# Altium schematic sheet STM32F10XV.SCHDOC
size A3
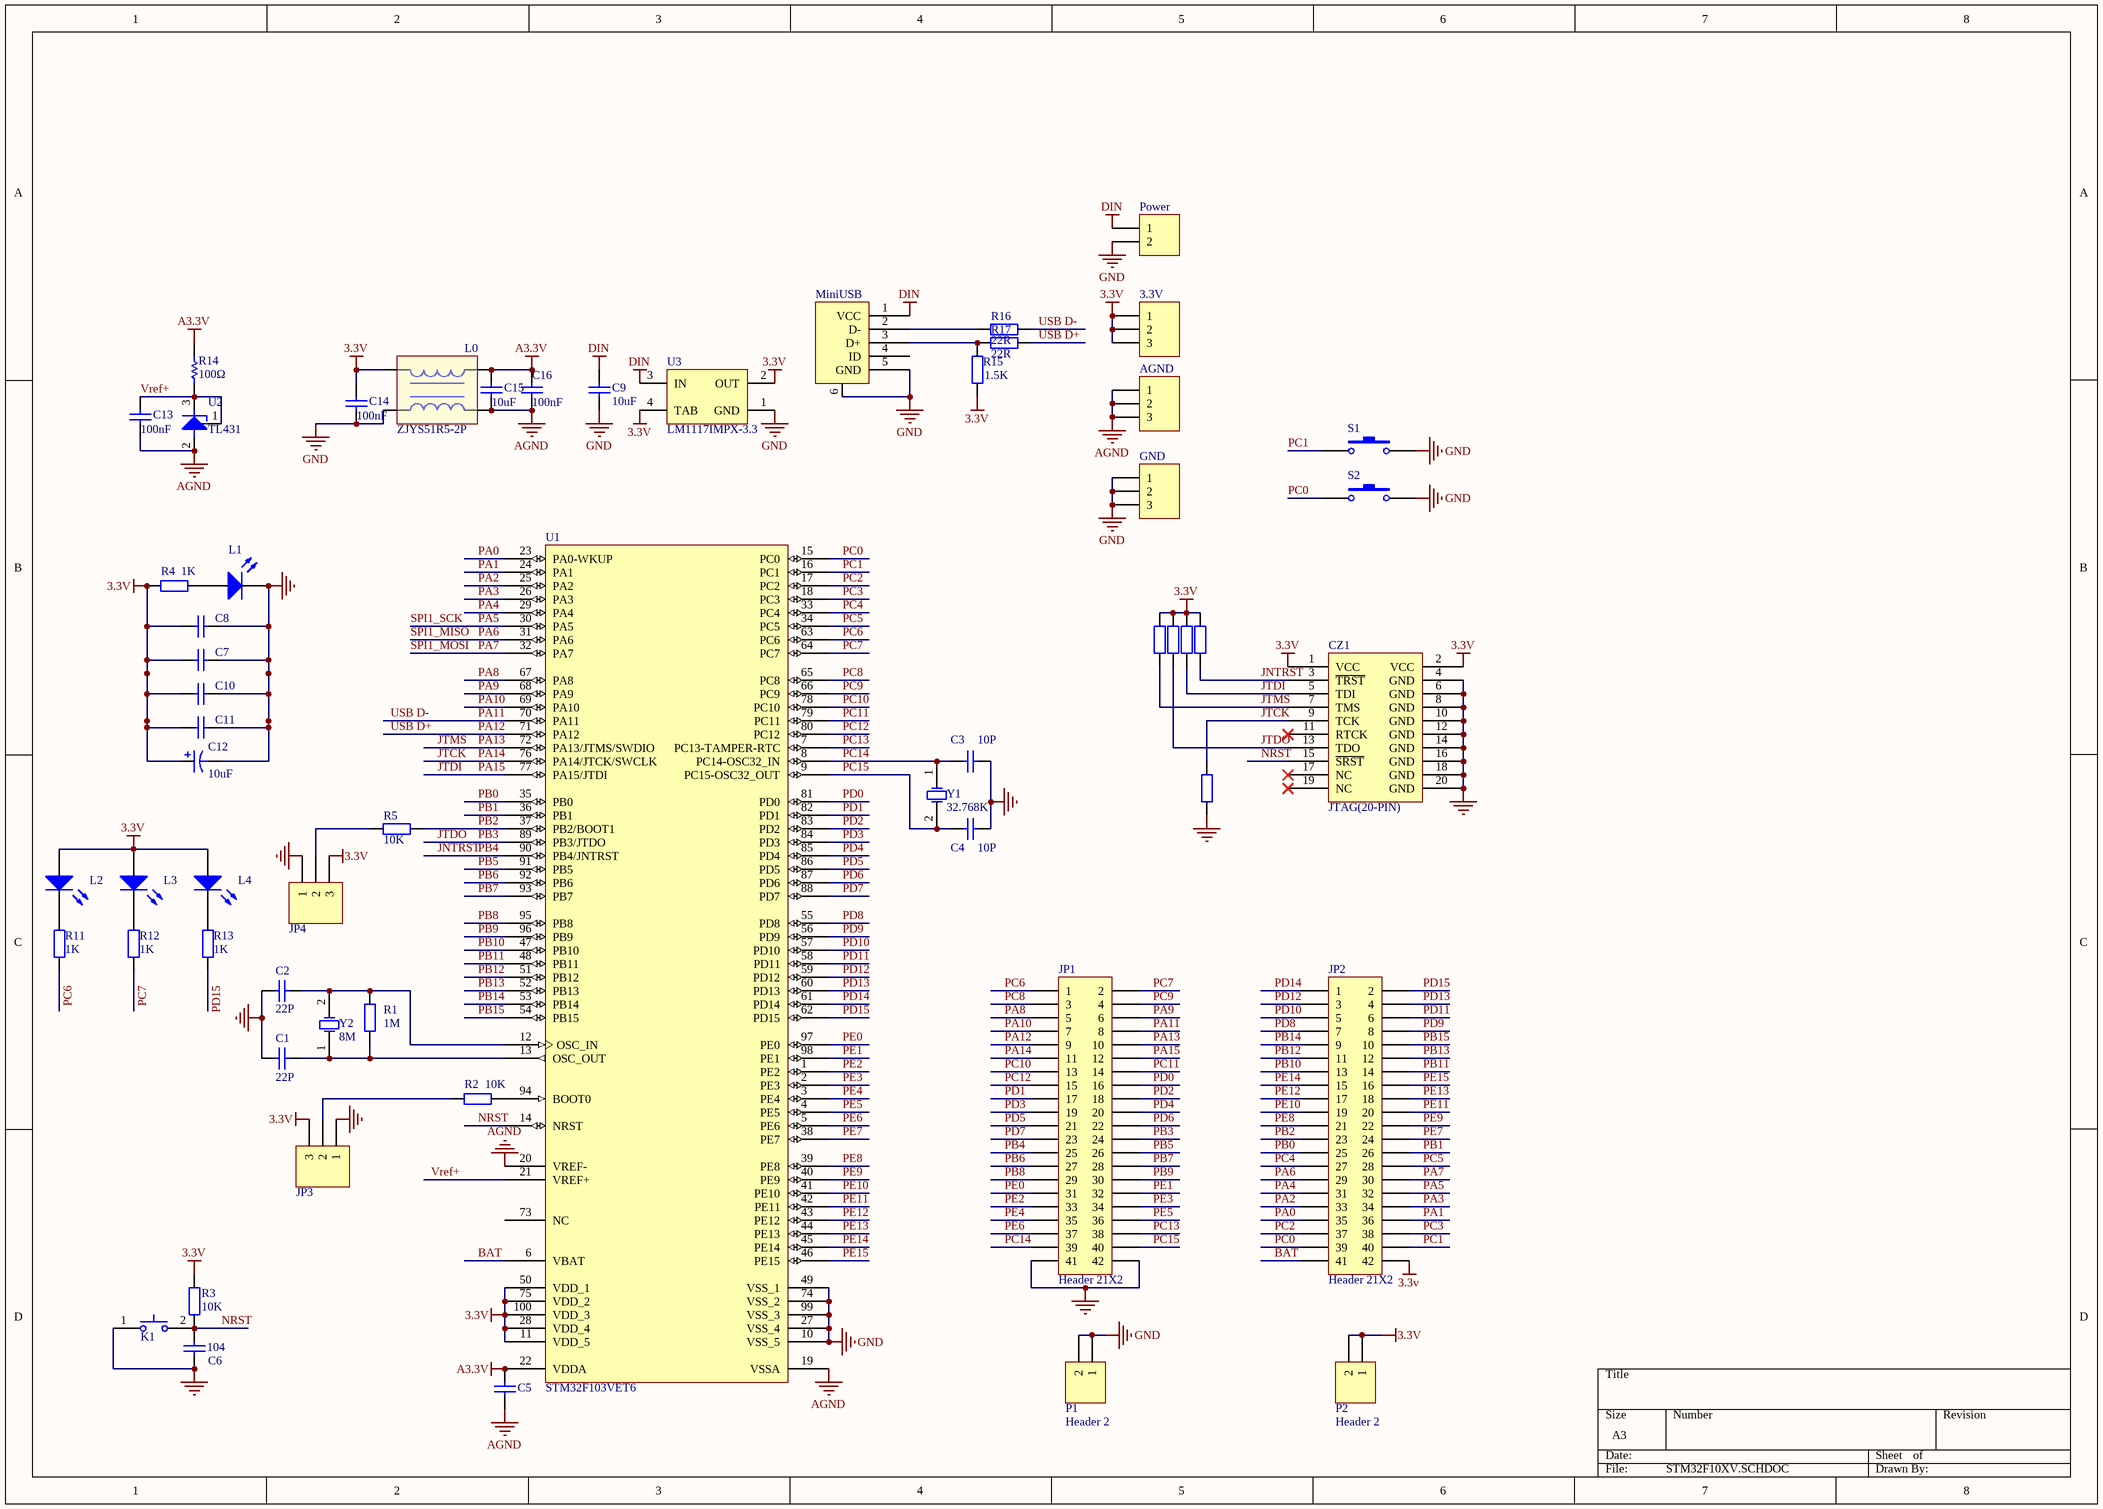
[diagram p0: STM32F10XV.SCHDOC]

## Parts
3.3V  3.3V  [HDR1X3]  (value not drawn)
AGND  AGND  [HDR1X3]  (value not drawn)
C1  22P  [0805]
C2  22P  [0805]
C3  10P  [0805]
C4  10P  [0805]
C5  (no value)  [0805]
C6  104  [0805]
C7  (no value)  [0603]
C8  (no value)  [0603]
C9  value 10uF  [1206]  (hidden comment: Cap)
C10  (no value)  [0603]
C11  (no value)  [0603]
C12  10uF  [1206]
C13  value 100nF  [0805]  (hidden comment: Cap)
C14  value 100nF  [0603]  (hidden comment: Cap)
C15  value 10uF  [0805]  (hidden comment: Cap)
C16  value 100nF  [0805]  (hidden comment: Cap)
CZ1  JTAG(20-PIN)  [JP20_DOMNLOAD]
GND  GND  [HDR1X3]  (value not drawn)
JP1  Header 21X2  [HDR2X21]
JP2  Header 21X2  [HDR2X21]
JP3  (no value)  [KEY_22D00]
JP4  (no value)  [KEY_22D00]
K1  (no value)  [棕色小按键开关]
L0  ZJYS51R5-2P  [DLW21SN121SQ2L]
L1  (no value)  [0805]
L2  LED0  [0805]  (value not drawn)
L3  LED0  [0805]  (value not drawn)
L4  LED0  [0805]  (value not drawn)
MiniUSB  miniUSB  [miniUSB]  (value not drawn)
P1  Header 2  [HDR1X2]
P2  Header 2  [HDR1X2]
Power  Header 2  [XH2.54]  (value not drawn)
R1  1M  [0805]
R2  10K  [0805]
R3  10K  [0805]
R4  1K  [0805]
R5  10K  [0805]
R6  10K  [0805]  (value not drawn)
R7  10K  [0805]  (value not drawn)
R8  10K  [0805]  (value not drawn)
R9  10K  [0805]  (value not drawn)
R10  10K  [0805]  (value not drawn)
R11  1K  [0805]
R12  1K  [0805]
R13  1K  [0805]
R14  value 100Ω  [0805]  (hidden comment: 10K)
R15  value 1.5K  [0805]  (hidden comment: Res2)
R16  value 22R  [0805]  (hidden comment: Res2)
R17  value 22R  [0805]  (hidden comment: Res2)
S1  SW-PB  [key-tiepian]  (value not drawn)
S2  SW-PB  [key-tiepian]  (value not drawn)
U1  STM32F103VET6  [LQFP100_N]
U2  TL431  [SOT23-3]
U3  LM1117IMPX-3.3  [MP04A_N]
Y1  32.768K  [2*6晶振]
Y2  8M  [XTAL]

## Nets
3.3v: 3.3V.1 3.3V.2 3.3V.3 C7.2 C8.2 C10.2 C11.2 C12.1 C14.2 CZ1.1(VCC) CZ1.2(VCC) JP2.42 JP3.3 JP4.3 L0.3 L2.1(A) L3.1(A) L4.1(A) P2.1 P2.2 R3.2 R4.2 R6.2 R7.2 R8.2 R9.2 R15.1 U1.11(VDD_5) U1.28(VDD_4) U1.50(VDD_1) U1.75(VDD_2) U1.100(VDD_3) U3.2(OUT) U3.4(TAB)
A3.3V: C5.2 C15.2 C16.2 L0.2 R14.1 U1.22(VDDA)
AGND: AGND.1 AGND.2 AGND.3 C5.1 C13.2 C15.1 C16.1 L0.1 U1.19(VSSA) U1.20(VREF-) U2.2(K)
DIN: C9.2 MiniUSB.1(VCC) Power.1 U3.3(IN)
GND: C1.2 C2.2 C3.1 C4.1 C6.1 C7.1 C8.1 C9.1 C10.1 C11.1 C12.2 C14.1 CZ1.4(GND) CZ1.6(GND) CZ1.8(GND) CZ1.10(GND) CZ1.12(GND) CZ1.14(GND) CZ1.16(GND) CZ1.18(GND) CZ1.20(GND) GND.1 GND.2 GND.3 JP1.41 JP1.42 JP3.1 JP4.1 K1.1(COMMON1) L0.4 L1.2(K) MiniUSB.5(GND) MiniUSB.6 P1.1 P1.2 Power.2 R10.1 S1.2 S2.2 U1.10(VSS_5) U1.27(VSS_4) U1.49(VSS_1) U1.74(VSS_2) U1.99(VSS_3) U3.1(GND)
BAT: JP2.41 U1.6(VBAT)
JNTRST: CZ1.3(~{TRST}) JP1.25 R9.1 U1.90(PB4/JNTRST)  [also labelled PB4]
JTCK: CZ1.9(TCK) JP1.11 R10.2 U1.76(PA14/JTCK/SWCLK)  [also labelled PA14]
JTDI: CZ1.5(TDI) JP1.12 R8.1 U1.77(PA15/JTDI)  [also labelled PA15]
JTDO: CZ1.13(TDO) JP1.24 R7.1 U1.89(PB3/JTDO)  [also labelled PB3]
JTMS: CZ1.7(TMS) JP1.10 R6.1 U1.72(PA13/JTMS/SWDIO)  [also labelled PA13]
NRST: C6.2 CZ1.15(~{SRST}) K1.2(NO1) R3.1 U1.14(NRST)
PA0: JP2.35 U1.23(PA0-WKUP)
PA1: JP2.36 U1.24(PA1)
PA2: JP2.33 U1.25(PA2)
PA3: JP2.34 U1.26(PA3)
PA4: JP2.31 U1.29(PA4)
PA5: JP2.32 U1.30(PA5)  [also labelled SPI1_SCK]
PA6: JP2.29 U1.31(PA6)  [also labelled SPI1_MISO]
PA7: JP2.30 U1.32(PA7)  [also labelled SPI1_MOSI]
PA8: JP1.5 U1.67(PA8)
PA9: JP1.6 U1.68(PA9)
PA10: JP1.7 U1.69(PA10)
PA11: JP1.8 R16.2 U1.70(PA11)  [also labelled USB D-]
PA12: JP1.9 R17.2 U1.71(PA12)  [also labelled USB D+]
PB0: JP2.25 U1.35(PB0)
PB1: JP2.26 U1.36(PB1)
PB2: JP2.23 R5.2 U1.37(PB2/BOOT1)
PB5: JP1.26 U1.91(PB5)
PB6: JP1.27 U1.92(PB6)
PB7: JP1.28 U1.93(PB7)
PB8: JP1.29 U1.95(PB8)
PB9: JP1.30 U1.96(PB9)
PB10: JP2.13 U1.47(PB10)
PB11: JP2.14 U1.48(PB11)
PB12: JP2.11 U1.51(PB12)
PB13: JP2.12 U1.52(PB13)
PB14: JP2.9 U1.53(PB14)
PB15: JP2.10 U1.54(PB15)
PC0: JP2.39 S2.1 U1.15(PC0)
PC1: JP2.40 S1.1 U1.16(PC1)
PC2: JP2.37 U1.17(PC2)
PC3: JP2.38 U1.18(PC3)
PC4: JP2.27 U1.33(PC4)
PC5: JP2.28 U1.34(PC5)
PC6: JP1.1 R11.1 U1.63(PC6)
PC7: JP1.2 R12.1 U1.64(PC7)
PC8: JP1.3 U1.65(PC8)
PC9: JP1.4 U1.66(PC9)
PC10: JP1.13 U1.78(PC10)
PC11: JP1.14 U1.79(PC11)
PC12: JP1.15 U1.80(PC12)
PC13: JP1.38 U1.7(PC13-TAMPER-RTC)
PC14: C3.2 JP1.39 U1.8(PC14-OSC32_IN) Y1.1(OSC1)
PC15: C4.2 JP1.40 U1.9(PC15-OSC32_OUT) Y1.2(OSC2)
PD0: JP1.16 U1.81(PD0)
PD1: JP1.17 U1.82(PD1)
PD2: JP1.18 U1.83(PD2)
PD3: JP1.19 U1.84(PD3)
PD4: JP1.20 U1.85(PD4)
PD5: JP1.21 U1.86(PD5)
PD6: JP1.22 U1.87(PD6)
PD7: JP1.23 U1.88(PD7)
PD8: JP2.7 U1.55(PD8)
PD9: JP2.8 U1.56(PD9)
PD10: JP2.5 U1.57(PD10)
PD11: JP2.6 U1.58(PD11)
PD12: JP2.3 U1.59(PD12)
PD13: JP2.4 U1.60(PD13)
PD14: JP2.1 U1.61(PD14)
PD15: JP2.2 R13.1 U1.62(PD15)
PE0: JP1.31 U1.97(PE0)
PE1: JP1.32 U1.98(PE1)
PE2: JP1.33 U1.1(PE2)
PE3: JP1.34 U1.2(PE3)
PE4: JP1.35 U1.3(PE4)
PE5: JP1.36 U1.4(PE5)
PE6: JP1.37 U1.5(PE6)
PE7: JP2.24 U1.38(PE7)
PE8: JP2.21 U1.39(PE8)
PE9: JP2.22 U1.40(PE9)
PE10: JP2.19 U1.41(PE10)
PE11: JP2.20 U1.42(PE11)
PE12: JP2.17 U1.43(PE12)
PE13: JP2.18 U1.44(PE13)
PE14: JP2.15 U1.45(PE14)
PE15: JP2.16 U1.46(PE15)
Vref+: C13.1 R14.2 U1.21(VREF+) U2.1(VREF) U2.3(A)
NetC1_1: C1.1 R1.1 U1.13(OSC_OUT) Y2.1(OSC1)
NetC2_1: C2.1 R1.2 U1.12(OSC_IN) Y2.2(OSC2)
NetJP3_2: JP3.2 R2.1
NetJP4_2: JP4.2 R5.1
NetL1_1: L1.1(A) R4.1
NetL2_2: L2.2(K) R11.2
NetL3_2: L3.2(K) R12.2
NetL4_2: L4.2(K) R13.2
NetMiniUSB_2: MiniUSB.2(D-) R16.1
NetMiniUSB_3: MiniUSB.3(D+) R15.2 R17.1
NetR2_2: R2.2 U1.94(BOOT0)

Not connected (* = marked no-connect by the designer): CZ1 11(RTCK)* 17(NC)* 19(NC)*; MiniUSB 4(ID); U1 73(NC)

## Library data of the parts
3.3V AGND GND JP3 JP4 = Header 3: Header, 3-Pin; Publisher: Altium Limited
  3.3V AGND GND: LatestRevisionDate: 17-Jul-2002; LatestRevisionNote: Re-released for DXP Platform.
  JP3 JP4: Revision: 17-Jul-2002: Re-released for DXP Platform.
C1-C8 C10 C11 = Cap: Capacitor; Value: 100pF; Published: 8-Jun-2000; Revision: July-2002: Re-released for DXP Platform.; Publisher: Altium Limited
C9 C13-C16 = Cap: Capacitor; Published: 8-Jun-2000; LatestRevisionDate: 17-Jul-2002; LatestRevisionNote: Re-released for DXP Platform.; PackageReference: RAD-0.3; Publisher: Altium Limited
  C9: PackageDescription: Radial Cap, Thru-Hole; 2 Leads; 0.3 in Pin Spacing
C12 = Cap Pol2: Polarized Capacitor (Axial); Value: 100pF; Published: 8-Jun-2000; Revision: July-2002: Re-released for DXP Platform.; Publisher: Altium Limited
JP1 JP2 = Header 21X2: Header, 22-Pin, Dual row; Revision: 17-Jul-2002: Re-released for DXP Platform.; Publisher: Altium Limited
K1 = 按键开关(小): 棕色
L1 = 方形LED
L2-L4 = LED0: Typical INFRARED GaAs LED; Published: 8-Jun-2000; LatestRevisionDate: 08-Jul-2005; LatestRevisionNote: Mech Layer 1 removed.; PackageReference: LED-0; Publisher: Altium Limited; PackageDescription: LED; 2 Leads
P1 P2 Power = Header 2: Header, 2-Pin; LatestRevisionDate: 17-Jul-2002; LatestRevisionNote: Re-released for DXP Platform.; Publisher: Altium Limited
R1-R3 R5-R10 = Res2: Resistor; Value: 1K; Published: 8-Jun-2000; Revision: July-2002: Re-released for DXP Platform.; Publisher: Altium Limited
R4 R11-R13 R15-R17 = Res2: Resistor; Published: 8-Jun-2000; Publisher: Altium Limited
  R4 R11-R13: Revision: July-2002: Re-released for DXP Platform.; Value: 1K
  R15-R17: LatestRevisionDate: 17-Jul-2002; LatestRevisionNote: Re-released for DXP Platform.; PackageReference: AXIAL-0.4; PackageDescription: Axial Device, Thru-Hole; 2 Leads; 0.4 in Pin Spacing
R14 = Res1: Resistor; Published: 8-Jun-2000; LatestRevisionDate: 17-Jul-2002; LatestRevisionNote: Re-released for DXP Platform.; PackageReference: AXIAL-0.3; Publisher: Altium Limited
S1 S2 = SW-PB: Switch; Published: 24-Mar-1999; LatestRevisionDate: 17-Jul-2002; LatestRevisionNote: Re-released for DXP Platform.; PackageReference: SPST-2; Publisher: Altium Limited; PackageDescription: Switch; 2 Leads
U1 = STM32F101V8T6: STM32 ARM-based 32-bit MCU with 64 Kbytes Flash, 100-pin LQFP, Industrial Temperature; Published: *; DatasheetVersion: *; PackageVersion: *; PackageReference: *; Publisher: *; PackageDescription: *; ComponentLink1Description: *; ComponentLink1URL: *; ComponentLink2Description: *; ComponentLink2URL: *
U2 = TL431: pin to pad: 2>3 3>2
U3 = LM1117IMPX-3.3: 800mA Low-Dropout Linear Regulator, 4-pin SOT-223; Manufacturer: National Semiconductor; PackageTopMarking: XYTT*N05B; PowerWise: N; CompType: LDO IC; Published: 1-Mar-2010; DatasheetVersion: Apr-2006; PackageVersion: revB, Apr-2003; PackageReference: MP04A; Publisher: Altium Limited; PackageDescription: Molded SOT-223, 6.50 x 3.56 x 1.6mm Body, 4 Lead, 2.3mm Pitch; PartNumber: LM1117IMPX-3.3; RoHS: N; PinCount: 4; Code_JEDEC: TO-261-AA; Code_IPC: SOT223-4; ComponentLink1Description: LM1117 Datasheet; ComponentLink1URL: http://www.national.com/ds/LM/LM1117.pdf; ComponentLink2Description: LM1117 Web Page; ComponentLink2URL: http://www.national.com/pf/LM/LM1117.html; ComponentLink3Description: MP04A Package Page; ComponentLink3URL: http://www.national.com/packaging/folders/mp04a.html
Y1 Y2 = XTAL: Crystal Oscillator; Published: 8-Jun-2000; Revision: July-2002: Re-released for DXP Platform.; Publisher: Altium Limited